# Altium schematic sheet JTAGHub.SchDoc
size A0
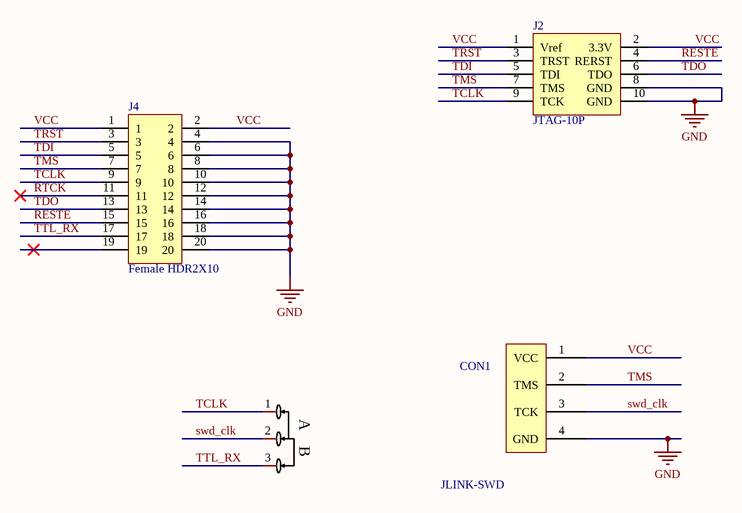
[diagram p0: JTAGHub.SchDoc]

## Parts
CON1  JLINK-SWD  [Jlink-SWD]
J2  JTAG-10P  [JTAG-10pin]
J4  Female HDR2X10  [Jlink]
SW??  TA-3530A-A2  [SW-3P]  (value not drawn)

## Nets
GND: CON1.4(GND) J2.8(GND) J2.10(GND) J4.4 J4.6 J4.8 J4.10 J4.12 J4.14 J4.16 J4.18 J4.20
RESTE: J2.4(RERST) J4.15
RTCK: J4.11
swd_clk: CON1.3(TCK) SW??.2
TCLK: J2.9(TCK) J4.9 SW??.1
TDI: J2.5(TDI) J4.5
TDO: J2.6(TDO) J4.13
TMS: CON1.2(TMS) J2.7(TMS) J4.7
TRST: J2.3(TRST) J4.3
TTL_RX: J4.17 SW??.3
VCC: CON1.1(VCC) J2.1(Vref) J2.2(3.3V) J4.1 J4.2

Not connected (* = marked no-connect by the designer): J4 19*

## Notes on the sheet
- (in symbol SW-3P) A; B

## Library data of the parts
CON1 = JLINK-SWD: SWD下载接口
J2 = JTAG-10P: 10pin JTAG
SW?? = SW-3P: 2选1滑动开关; Manufacturer: Yuandi(元迪); Add into BOM: yes; Name: TA-3530A-A2; Symbol: TA-3530A-A2; Device: TA-3530A-A2; LCSC Part Name: 滑动开关9.1*3.5*3.0mm贴片正拨三脚二档; Supplier Part: C514025; Manufacturer Part: TA-3530A-A2; Supplier Footprint: SMD,9.1x3.5mm; JLCPCB Part Class: Extended Part; Datasheet: https://atta.szlcsc.com/upload/public/pdf/source/20200415/C514026_8B08460025BDC38443E709528B1B4516.pdf; Supplier: LCSC; Convert to PCB: yes